# EAGLE design sensor-gps (EAGLE 5.12)
DRAWING_AUTHOR: Roberto Benedito de Oliveira Pereira
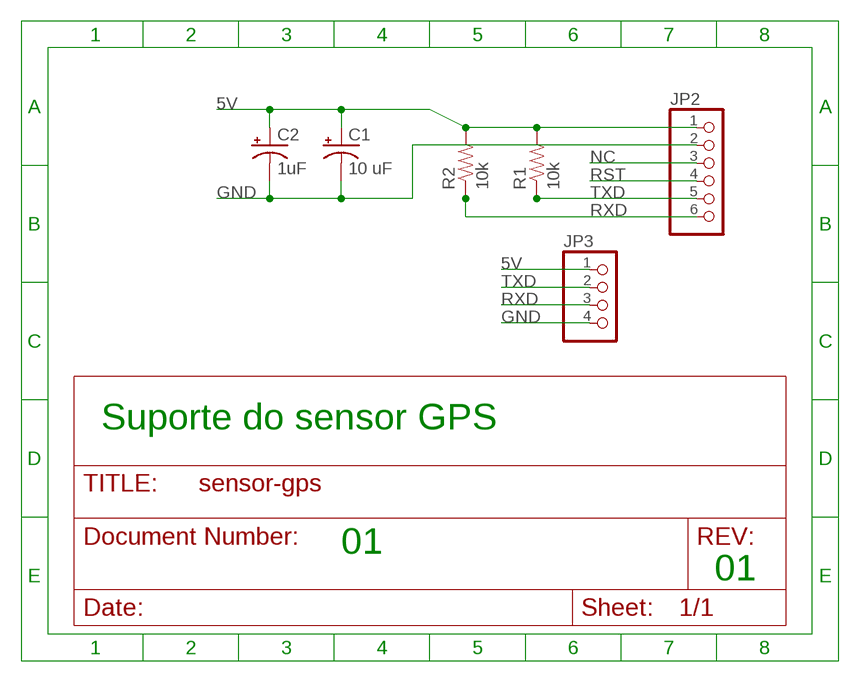
[diagram p0: schematic, sheet 1]

## Parts
C1  10 uF  CAP_POLPTH2  [CPOL-RADIAL-10UF-25V]
C2  1uF  CAP_POLPTH2  [CPOL-RADIAL-10UF-25V]
JP2  PINHD-1X06_2.00  [1X06M]
JP3  PINHD-1X4  [1X04]
R1  10k  RESISTORPTH-1/4W  [AXIAL-0.4]
R2  10k  RESISTORPTH-1/4W  [AXIAL-0.4]

## Nets
5V: C1.1(+) C2.1(+) JP2.1 JP3.1 R1.P$2 R2.P$2
GND: C1.2(-) C2.2(-) JP2.2 JP3.4
NC: JP2.3
RST: JP2.4
RXD: JP2.6 JP3.3 R2.P$1
TXD: JP2.5 JP3.2 R1.P$1

## Notes on the sheet
- Suporte do sensor GPS
- 01
- 01

## Library data of the parts
C1 C2 = SparkFun:CAP_POL: Capacitor Polarized These are standard SMD and PTH capacitors. Normally 10uF, 47uF, and 100uF in electrolytic and tantalum varieties. Always verify the external diameter of the through hole cap, it varies with capacity, voltage, and manufacturer. The EIA devices should be standard.
JP2 = pinhead-2:PINHD-1X06: PIN HEADER
JP3 = pinhead:PINHD-1X4: PIN HEADER
R1 R2 = SparkFun:RESISTOR: Resistor Basic schematic elements and footprints for 0603, 1206, and PTH resistors.

## Board
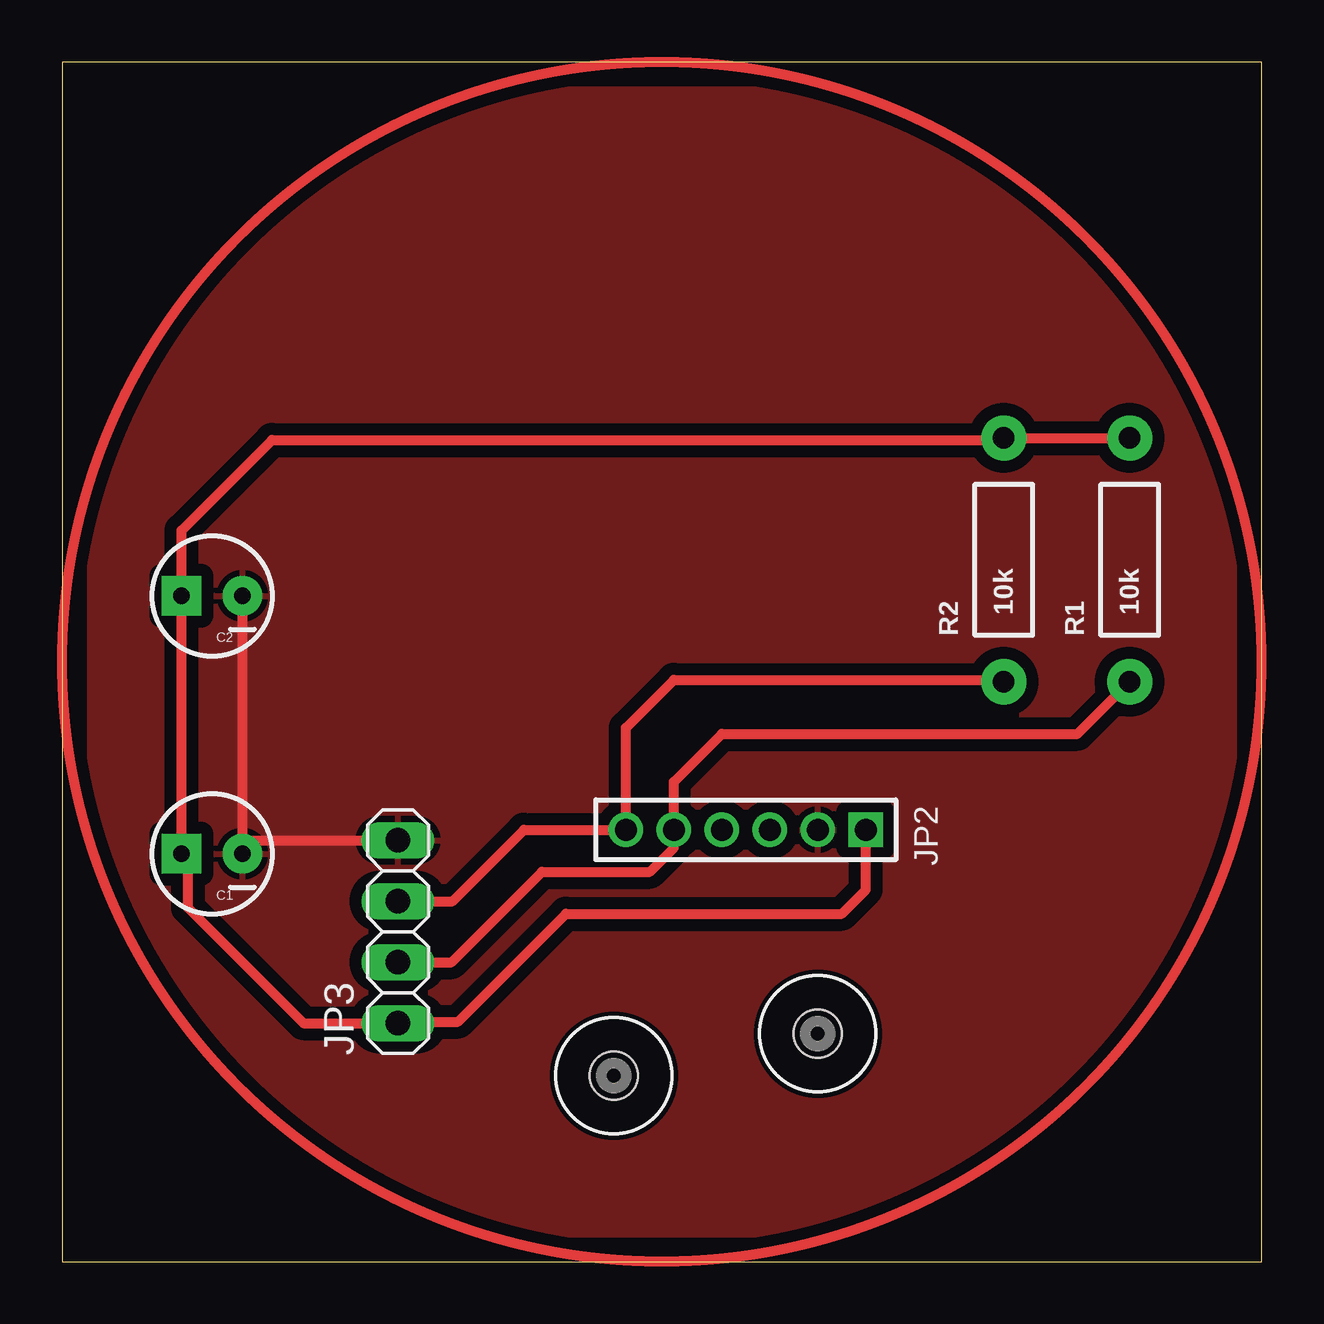
[diagram p1: board, top side]
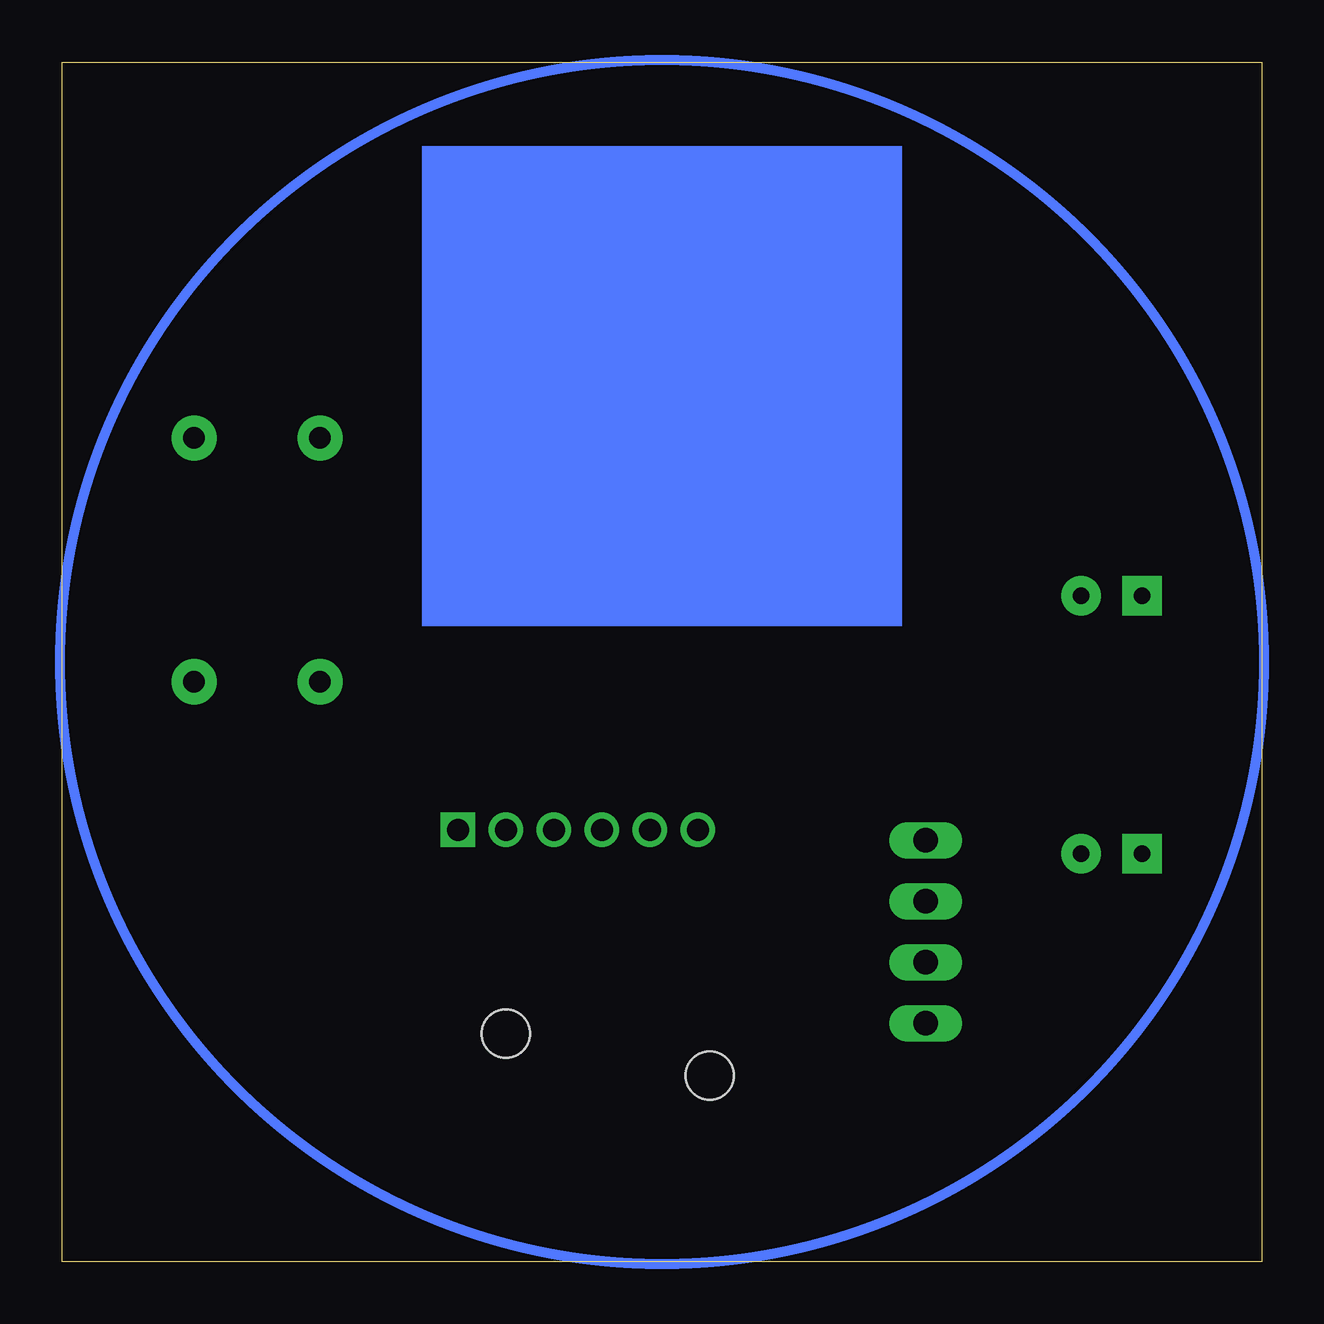
[diagram p2: board, bottom side, seen from below]

Size 50 x 50 mm. Coordinates in mm from the lower left corner, seen from the top.
Outline: 0,0 50,0 50,50 0,50 0,0
Copper layers (1*16): Top 0.035mm / dielectric 1.5mm / Bottom 0.035mm
Design rules "default *": minimum track width 10mil, minimum drill 24mil, track to track 20mil, track to pad 20mil, pad to pad 20mil, via to via 20mil, smd to smd 20mil, copper to edge 40mil, drill to drill 8mil, minimum pad ring 10mil, minimum via ring 8mil, stop-mask expansion 4mil, vias tented up to drill 0mil, thermal gap 10mil

### Footprints (pad centres in the part's own frame; a part is rotated, then mirrored left to right if it is on the bottom)
CPOL-RADIAL-10UF-25V = drill 0.7 pad 1.651 square: 1 1.27,0 | drill 0.7 pad 1.651 round: 2 -1.27,0
1X06M = drill 0.914 square: 1 -5,0 | drill 0.914 round: 2 -3,0; 3 -1,0; 4 1,0; 5 3,0; 6 5,0
1X04 = drill 1.016 long: 1 -3.81,0; 2 -1.27,0; 3 1.27,0; 4 3.81,0
AXIAL-0.4 = drill 0.9 pad 1.88 round: P$1 -5.08,0; P$2 5.08,0
DRIL-2 = hole 2: 0,0

### Placement (x,y rotation side)
C1  6.25,17 180 top
C2  6.25,27.75 180 top
JP2  28.5,18 180 top
JP3  14,13.75 90 top
R1  44.5,29.25 90 top
R2  39.25,29.25 90 top
U$1  [DRIL-2]  23,7.75 0 top
U$2  [DRIL-2]  31.5,9.5 0 top

### Tracks (layer width: path | path; a pad name or v marks a point on that pad's centre or on a via)
5V
  Top 0.406: C1.1 C2.1 4.98,30.48 8.75,34.25 39.17,34.25 R2.P$2 R1.P$2 | C1.1 5,16.98 | C1.1 5.25,16.73 5.25,14.75 10.06,9.94 JP3.1 14.06,10 16.5,10 21,14.5 32.5,14.5 33.5,15.5 JP2.1
GND
  Top 0.406: 7.52,17.5 7.52,21.25 C2.2 | C1.2 7.52,17.5 | JP3.4 7.58,17.56 7.52,17.5
  pour Top: 0,0 0,50 50,50 50,0
RXD
  Top 0.406: JP3.3 16.27,15.02 19.25,18 JP2.6 23.5,22.25 25.5,24.25 39.17,24.25 R2.P$1
TXD
  Top 0.406: JP3.2 16.23,12.48 20,16.25 24.5,16.25 25.5,17.25 JP2.5 25.5,20 27.5,22 42.33,22 R1.P$1
(copper drawn outside any net)
  shapes: Bottom area x1, Bottom circle x1, Top circle x1